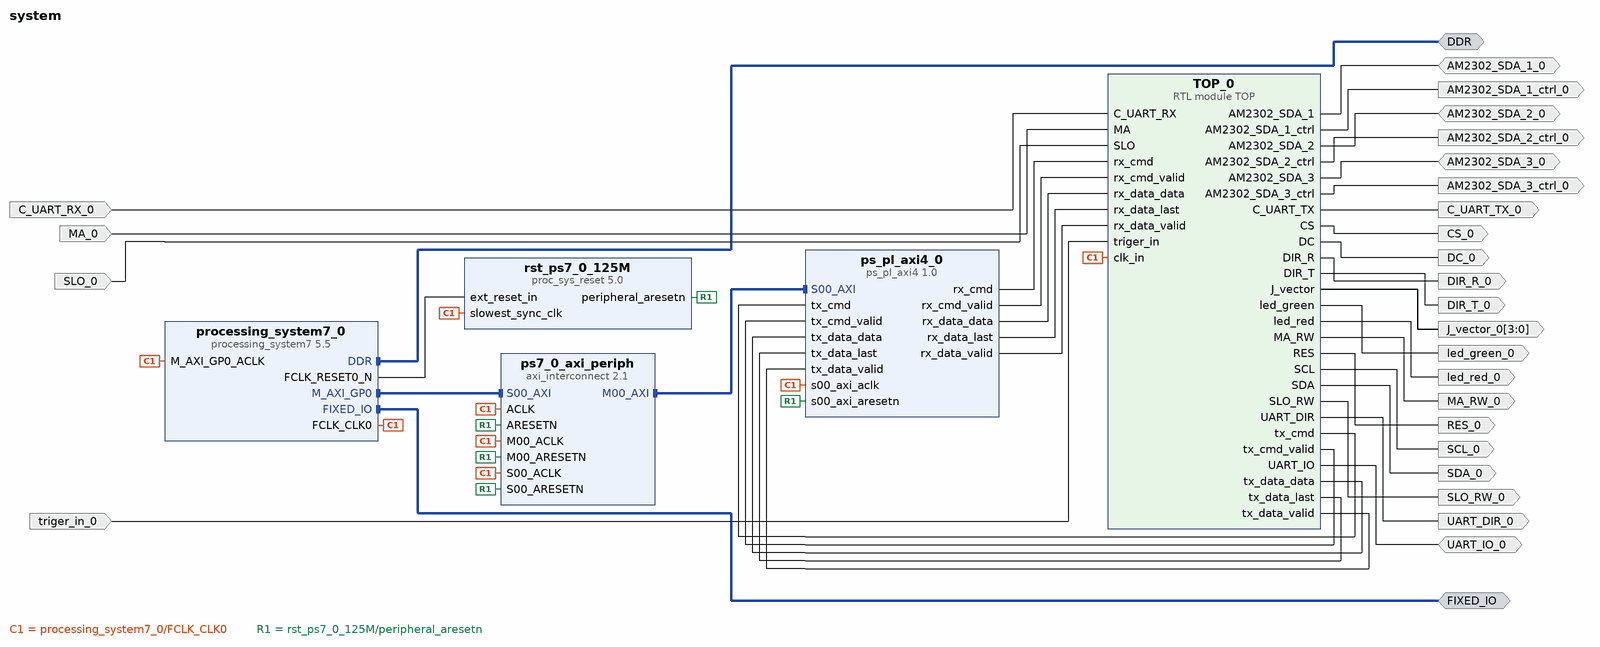
[diagram p0: block diagram of the top level]
# Vivado block design system, xc7z020clg400-2, Vivado 2021.1
create_bd_design system

create_bd_intf_port -mode Master -vlnv xilinx.com:interface:ddrx_rtl:1.0 DDR
create_bd_intf_port -mode Master -vlnv xilinx.com:display_processing_system7:fixedio_rtl:1.0 FIXED_IO
create_bd_port -dir IO AM2302_SDA_1_0
create_bd_port -dir O AM2302_SDA_1_ctrl_0
create_bd_port -dir IO AM2302_SDA_2_0
create_bd_port -dir O AM2302_SDA_2_ctrl_0
create_bd_port -dir IO AM2302_SDA_3_0
create_bd_port -dir O AM2302_SDA_3_ctrl_0
create_bd_port -dir O CS_0
create_bd_port -dir I C_UART_RX_0
create_bd_port -dir O C_UART_TX_0
create_bd_port -dir O DC_0
create_bd_port -dir O DIR_R_0
create_bd_port -dir O DIR_T_0
create_bd_port -dir O -from 3 -to 0 J_vector_0
create_bd_port -dir I MA_0
create_bd_port -dir O MA_RW_0
create_bd_port -dir O RES_0
create_bd_port -dir O SCL_0
create_bd_port -dir O SDA_0
create_bd_port -dir I SLO_0
create_bd_port -dir O SLO_RW_0
create_bd_port -dir O UART_DIR_0
create_bd_port -dir IO UART_IO_0
create_bd_port -dir O led_green_0
create_bd_port -dir O led_red_0
create_bd_port -dir I triger_in_0

create_bd_cell -type ip -vlnv xilinx.com:ip:processing_system7:5.5 processing_system7_0
set_property -dict [list \
  CONFIG.PCW_QSPI_GRP_SINGLE_SS_ENABLE 1 \
  CONFIG.PCW_QSPI_GRP_SINGLE_SS_IO {MIO 1 .. 6} \
  CONFIG.PCW_SINGLE_QSPI_DATA_MODE x4 \
] [get_bd_cells processing_system7_0]
# 16 more settings of processing_system7_0 are not shown: defaults, MIO pin electricals, DDR timing, and values the tool derives
create_bd_cell -type ip -vlnv xilinx.com:ip:axi_interconnect:2.1 ps7_0_axi_periph
set_property -dict {CONFIG.NUM_MI 1} [get_bd_cells ps7_0_axi_periph]
create_bd_cell -type ip -vlnv xilinx.com:ip:proc_sys_reset:5.0 rst_ps7_0_125M
create_bd_cell -type ip -vlnv xilinx.com:user:ps_pl_axi4:1.0 ps_pl_axi4_0
create_bd_cell -type module -reference TOP TOP_0

# ---- connections ----

connect_bd_intf_net [get_bd_intf_ports DDR] [get_bd_intf_pins processing_system7_0/DDR]
connect_bd_intf_net [get_bd_intf_ports FIXED_IO] [get_bd_intf_pins processing_system7_0/FIXED_IO]
connect_bd_intf_net [get_bd_intf_pins processing_system7_0/M_AXI_GP0] [get_bd_intf_pins ps7_0_axi_periph/S00_AXI]
connect_bd_intf_net [get_bd_intf_pins ps7_0_axi_periph/M00_AXI] [get_bd_intf_pins ps_pl_axi4_0/S00_AXI]
connect_bd_net -net C_UART_RX_0_1 [get_bd_ports C_UART_RX_0] [get_bd_pins TOP_0/C_UART_RX]
connect_bd_net -net MA_0_1 [get_bd_ports MA_0] [get_bd_pins TOP_0/MA]
connect_bd_net [get_bd_ports AM2302_SDA_1_0] [get_bd_pins TOP_0/AM2302_SDA_1]
connect_bd_net [get_bd_ports AM2302_SDA_2_0] [get_bd_pins TOP_0/AM2302_SDA_2]
connect_bd_net [get_bd_ports AM2302_SDA_3_0] [get_bd_pins TOP_0/AM2302_SDA_3]
connect_bd_net [get_bd_ports UART_IO_0] [get_bd_pins TOP_0/UART_IO]
connect_bd_net -net SLO_0_1 [get_bd_ports SLO_0] [get_bd_pins TOP_0/SLO]
connect_bd_net [get_bd_pins TOP_0/AM2302_SDA_1_ctrl] [get_bd_ports AM2302_SDA_1_ctrl_0]
connect_bd_net [get_bd_pins TOP_0/AM2302_SDA_2_ctrl] [get_bd_ports AM2302_SDA_2_ctrl_0]
connect_bd_net [get_bd_pins TOP_0/AM2302_SDA_3_ctrl] [get_bd_ports AM2302_SDA_3_ctrl_0]
connect_bd_net [get_bd_pins TOP_0/CS] [get_bd_ports CS_0]
connect_bd_net [get_bd_pins TOP_0/C_UART_TX] [get_bd_ports C_UART_TX_0]
connect_bd_net [get_bd_pins TOP_0/DC] [get_bd_ports DC_0]
connect_bd_net [get_bd_pins TOP_0/DIR_R] [get_bd_ports DIR_R_0]
connect_bd_net [get_bd_pins TOP_0/DIR_T] [get_bd_ports DIR_T_0]
connect_bd_net [get_bd_pins TOP_0/J_vector] [get_bd_ports J_vector_0]
connect_bd_net [get_bd_pins TOP_0/MA_RW] [get_bd_ports MA_RW_0]
connect_bd_net [get_bd_pins TOP_0/RES] [get_bd_ports RES_0]
connect_bd_net [get_bd_pins TOP_0/SCL] [get_bd_ports SCL_0]
connect_bd_net [get_bd_pins TOP_0/SDA] [get_bd_ports SDA_0]
connect_bd_net [get_bd_pins TOP_0/SLO_RW] [get_bd_ports SLO_RW_0]
connect_bd_net [get_bd_pins TOP_0/UART_DIR] [get_bd_ports UART_DIR_0]
connect_bd_net [get_bd_pins TOP_0/led_green] [get_bd_ports led_green_0]
connect_bd_net [get_bd_pins TOP_0/led_red] [get_bd_ports led_red_0]
connect_bd_net [get_bd_pins TOP_0/tx_cmd] [get_bd_pins ps_pl_axi4_0/tx_cmd]
connect_bd_net [get_bd_pins TOP_0/tx_cmd_valid] [get_bd_pins ps_pl_axi4_0/tx_cmd_valid]
connect_bd_net [get_bd_pins TOP_0/tx_data_data] [get_bd_pins ps_pl_axi4_0/tx_data_data]
connect_bd_net [get_bd_pins TOP_0/tx_data_last] [get_bd_pins ps_pl_axi4_0/tx_data_last]
connect_bd_net [get_bd_pins TOP_0/tx_data_valid] [get_bd_pins ps_pl_axi4_0/tx_data_valid]
connect_bd_net [get_bd_pins processing_system7_0/FCLK_CLK0] \
  [get_bd_pins processing_system7_0/M_AXI_GP0_ACLK] [get_bd_pins ps7_0_axi_periph/S00_ACLK] \
  [get_bd_pins rst_ps7_0_125M/slowest_sync_clk] [get_bd_pins ps7_0_axi_periph/M00_ACLK] [get_bd_pins ps7_0_axi_periph/ACLK] \
  [get_bd_pins ps_pl_axi4_0/s00_axi_aclk] [get_bd_pins TOP_0/clk_in]
connect_bd_net [get_bd_pins processing_system7_0/FCLK_RESET0_N] [get_bd_pins rst_ps7_0_125M/ext_reset_in]
connect_bd_net [get_bd_pins ps_pl_axi4_0/rx_cmd] [get_bd_pins TOP_0/rx_cmd]
connect_bd_net [get_bd_pins ps_pl_axi4_0/rx_cmd_valid] [get_bd_pins TOP_0/rx_cmd_valid]
connect_bd_net [get_bd_pins ps_pl_axi4_0/rx_data_data] [get_bd_pins TOP_0/rx_data_data]
connect_bd_net [get_bd_pins ps_pl_axi4_0/rx_data_last] [get_bd_pins TOP_0/rx_data_last]
connect_bd_net [get_bd_pins ps_pl_axi4_0/rx_data_valid] [get_bd_pins TOP_0/rx_data_valid]
connect_bd_net [get_bd_pins rst_ps7_0_125M/peripheral_aresetn] \
  [get_bd_pins ps7_0_axi_periph/S00_ARESETN] [get_bd_pins ps7_0_axi_periph/M00_ARESETN] \
  [get_bd_pins ps7_0_axi_periph/ARESETN] [get_bd_pins ps_pl_axi4_0/s00_axi_aresetn]
connect_bd_net -net triger_in_0_1 [get_bd_ports triger_in_0] [get_bd_pins TOP_0/triger_in]

# ---- address map ----
assign_bd_address -offset 0x43C00000 -range 64K -target_address_space [get_bd_addr_spaces processing_system7_0/Data] [get_bd_addr_segs ps_pl_axi4_0/S00_AXI/S00_AXI_reg]

validate_bd_design
save_bd_design
